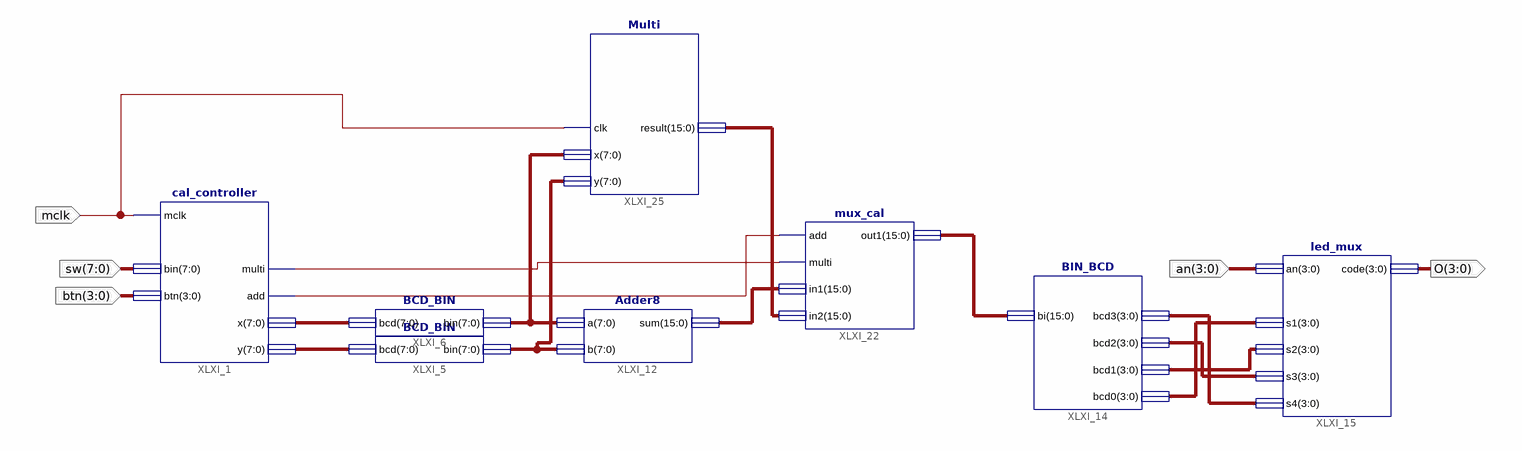
[diagram p0: schematic sheet 1]
// Xilinx ISE schematic calculator.sch (spartan3e) as structural Verilog: 8 symbols, 5 ports
module calculator (
  input  [3:0] an,
  input  [7:0] sw,
  input  [3:0] btn,
  input  mclk,
  output [3:0] O
);

  wire XLXN_57, XLXN_58;
  wire [3:0] XLXN_26, XLXN_27, XLXN_28, XLXN_29;
  wire [7:0] XLXN_13, XLXN_14, XLXN_72, XLXN_73;
  wire [15:0] XLXN_59, XLXN_60, XLXN_61;

  BIN_BCD XLXI_14 (.bi(XLXN_61), .bcd3(XLXN_29), .bcd2(XLXN_28), .bcd1(XLXN_27), .bcd0(XLXN_26));
  led_mux XLXI_15 (.an(an), .code(O), .s1(XLXN_26), .s2(XLXN_27), .s3(XLXN_28), .s4(XLXN_29));
  cal_controller XLXI_1 (.mclk(mclk), .bin(sw), .btn(btn), .multi(XLXN_57), .add(XLXN_58), .x(XLXN_14), .y(XLXN_13));
  BCD_BIN XLXI_5 (.bcd(XLXN_13), .bin(XLXN_73));
  BCD_BIN XLXI_6 (.bcd(XLXN_14), .bin(XLXN_72));
  Adder8 XLXI_12 (.a(XLXN_72), .b(XLXN_73), .sum(XLXN_59));
  mux_cal XLXI_22 (.add(XLXN_58), .multi(XLXN_57), .in1(XLXN_59), .in2(XLXN_60), .out1(XLXN_61));
  Multi XLXI_25 (.clk(mclk), .x(XLXN_72), .y(XLXN_73), .result(XLXN_60));
endmodule
